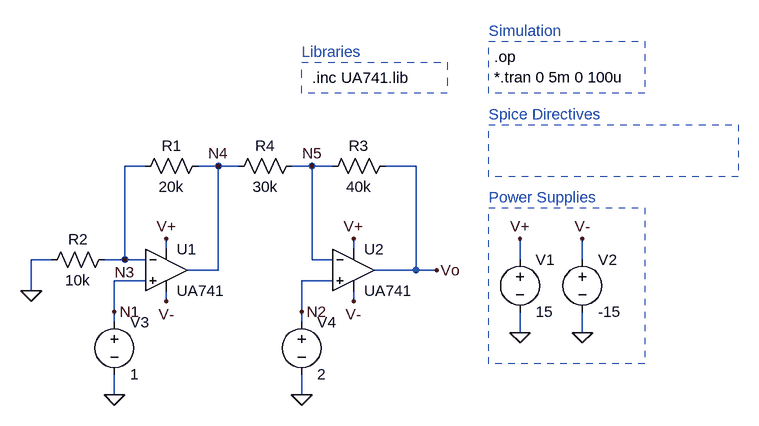
[diagram p0: schematic Example_1_DC.asc]
Example_1_DC.asc, the LTspice schematic file:
Version 4
SHEET 1 1432 696
WIRE 112 224 80 224
WIRE 224 224 192 224
WIRE 256 224 224 224
WIRE 368 224 336 224
WIRE 400 224 368 224
WIRE 528 224 480 224
WIRE 144 352 144 336
WIRE 432 352 432 336
WIRE -32 368 -64 368
WIRE 80 368 80 224
WIRE 80 368 48 368
WIRE 112 368 80 368
WIRE 368 368 368 224
WIRE 400 368 368 368
WIRE 688 368 688 336
WIRE 784 368 784 336
WIRE 224 384 224 224
WIRE 224 384 176 384
WIRE 528 384 528 224
WIRE 528 384 464 384
WIRE 560 384 528 384
WIRE 112 400 64 400
WIRE 400 400 352 400
WIRE -64 416 -64 368
WIRE 144 432 144 416
WIRE 432 432 432 416
WIRE 64 448 64 400
WIRE 352 448 352 400
WIRE 64 464 64 448
WIRE 352 464 352 448
WIRE 688 480 688 448
WIRE 784 480 784 448
WIRE 64 576 64 544
WIRE 352 576 352 544
FLAG 784 480 0
FLAG 688 480 0
FLAG 688 336 V+
FLAG 784 336 V-
FLAG 144 336 V+
FLAG 144 432 V-
FLAG 432 336 V+
FLAG 432 432 V-
FLAG -64 416 0
FLAG 560 384 Vo
FLAG 352 576 0
FLAG 64 576 0
FLAG 64 448 N1
FLAG 352 448 N2
FLAG 224 224 N4
FLAG 368 224 N5
FLAG 80 368 N3
SYMBOL OpAmps\\opamp2 144 320 R0
SYMATTR InstName U1
SYMATTR Value UA741
SYMBOL voltage 688 352 R0
SYMATTR InstName V1
SYMATTR Value 15
SYMBOL voltage 784 352 R0
SYMATTR InstName V2
SYMATTR Value -15
SYMBOL OpAmps\\opamp2 432 320 R0
SYMATTR InstName U2
SYMATTR Value UA741
SYMBOL res 208 208 R90
WINDOW 0 0 56 VBottom 2
WINDOW 3 32 56 VTop 2
SYMATTR InstName R1
SYMATTR Value 20k
SYMBOL res 64 352 R90
WINDOW 0 0 56 VBottom 2
WINDOW 3 32 56 VTop 2
SYMATTR InstName R2
SYMATTR Value 10k
SYMBOL res 496 208 R90
WINDOW 0 0 56 VBottom 2
WINDOW 3 32 56 VTop 2
SYMATTR InstName R3
SYMATTR Value 40k
SYMBOL res 352 208 R90
WINDOW 0 0 56 VBottom 2
WINDOW 3 32 56 VTop 2
SYMATTR InstName R4
SYMATTR Value 30k
SYMBOL voltage 64 448 R0
SYMATTR InstName V3
SYMATTR Value 1
SYMBOL voltage 352 448 R0
SYMATTR InstName V4
SYMATTR Value 2
TEXT 640 16 Left 2 ;Simulation
TEXT 368 88 Left 2 !.inc UA741.lib
TEXT 648 56 Left 2 !.op\n*.tran 0 5m 0 100u
TEXT 640 144 Left 2 ;Spice Directives
TEXT 640 272 Left 2 ;Power Supplies
TEXT 352 48 Left 2 ;Libraries
RECTANGLE Normal 1024 240 640 160 2
RECTANGLE Normal 880 528 640 288 2
RECTANGLE Normal 576 112 352 64 2
RECTANGLE Normal 880 112 640 32 2

The netlist it stands for:
* Example_1_DC.asc
XU1 N1 N3 V+ V- N4 UA741  ; pins In+ In- V+ V- OUT
V1 V+ 0 15
V2 V- 0 -15
XU2 N2 N5 V+ V- Vo UA741  ; pins In+ In- V+ V- OUT
R1 N4 N3 20k
R2 N3 0 10k
R3 Vo N5 40k
R4 N5 N4 30k
V3 N1 0 1
V4 N2 0 2
* Simulation
.inc UA741.lib
.op
*.tran 0 5m 0 100u
* Spice Directives
* Power Supplies
* Libraries
.backanno
.end